# EAGLE design BB-8 Dome FX Module (EAGLE 7.5.0)
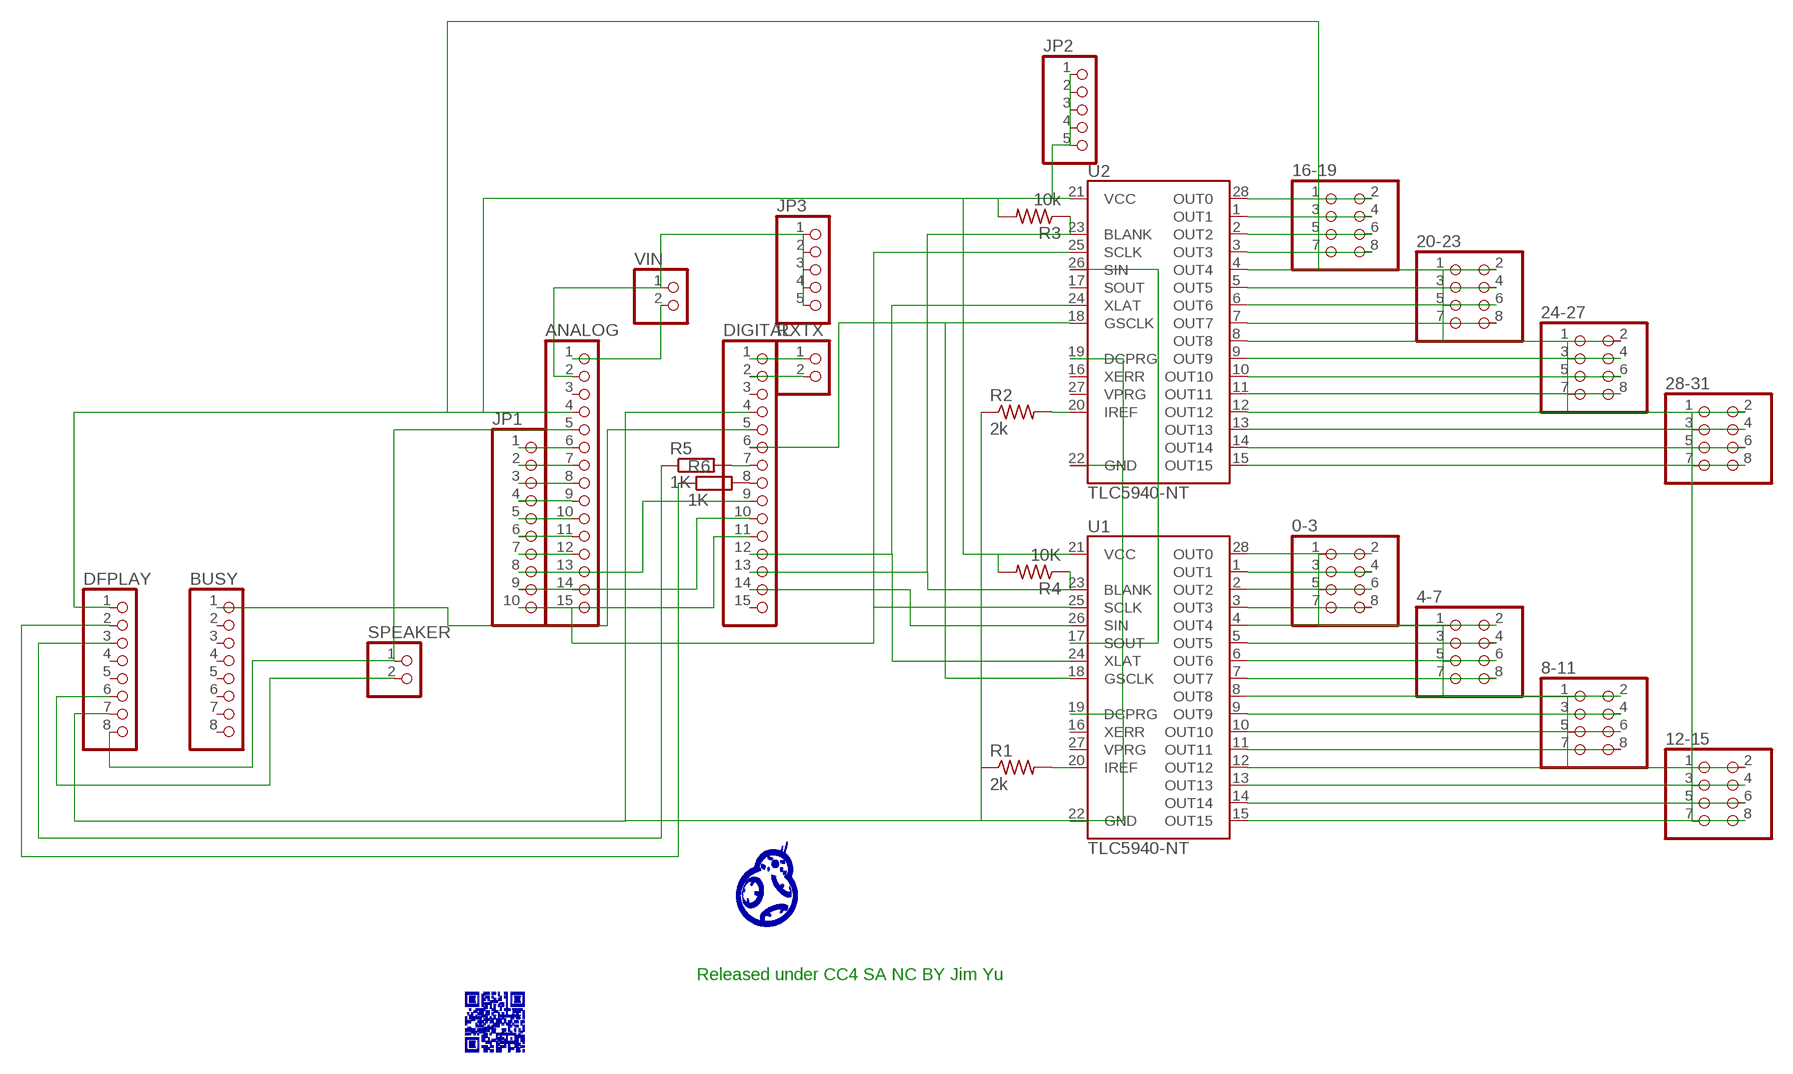
[diagram p0: schematic, sheet 1]

## Parts
0-3  PINHD-2X4  [2X04]
4-7  PINHD-2X4  [2X04]
8-11  PINHD-2X4  [2X04]
12-15  PINHD-2X4  [2X04]
16-19  PINHD-2X4  [2X04]
20-23  PINHD-2X4  [2X04]
24-27  PINHD-2X4  [2X04]
28-31  PINHD-2X4  [2X04]
ANALOG  PINHD-1X15  [1X15]
BUSY  PINHD-1X8  [1X08]
DFPLAY  PINHD-1X8  [1X08]
DIGITAL  PINHD-1X15  [1X15]
JP1  PINHD-1X10  [1X10]
JP2  PINHD-1X5  [1X05]
JP3  PINHD-1X5  [1X05]
R1  2k  R-US_0204/5  [0204/5]
R2  2k  R-US_0204/5  [0204/5]
R3  10k  R-US_0204/5  [0204/5]
R4  10K  R-US_0204/5  [0204/5]
R5  1K  R-EU_0204/5  [0204/5]
R6  1K  R-EU_0204/5  [0204/5]
RXTX  PINHD-1X2  [1X02]
SPEAKER  PINHD-1X2  [1X02]
U1  TLC5940-NT  [DIL28-3]
U2  TLC5940-NT  [DIL28-3]
VIN  PINHD-1X2  [1X02]

## Nets
N$1: DIGITAL.7 R5.2
N$2: U1.17(SOUT) U2.26(SIN)
N$3: DIGITAL.13 R3.1 R4.1 U1.23(BLANK) U2.23(BLANK)
N$4: DIGITAL.12 U1.24(XLAT) U2.24(XLAT)
N$5: DIGITAL.14 U1.26(SIN)
N$6: DIGITAL.6 U1.18(GSCLK) U2.18(GSCLK)
N$7: ANALOG.15 U1.25(SCLK) U2.25(SCLK)
N$8: DFPLAY.3 R5.1
N$9: R2.2 U2.20(IREF)
N$10: R1.2 U1.20(IREF)
N$11: DFPLAY.2 R6.1
N$12: DIGITAL.1 RXTX.1
N$13: 16-19.4 U2.1(OUT1)
N$14: DIGITAL.2 RXTX.2
N$16: 20-23.2 U2.4(OUT4)
N$17: 20-23.4 U2.5(OUT5)
N$28: 0-3.2 U1.28(OUT0)
N$29: 0-3.4 U1.1(OUT1)
N$30: 0-3.6 U1.2(OUT2)
N$31: 0-3.8 U1.3(OUT3)
N$33: 4-7.4 U1.5(OUT5)
N$36: 8-11.2 U1.8(OUT8)
N$37: 8-11.4 U1.9(OUT9)
N$38: 8-11.6 U1.10(OUT10)
N$39: 8-11.8 U1.11(OUT11)
N$41: 12-15.4 U1.13(OUT13)
N$42: 12-15.6 U1.14(OUT14)
N$43: 0-3.1 0-3.3 0-3.5 0-3.7 4-7.1 4-7.3 4-7.5 4-7.7 8-11.1 8-11.3 8-11.5 8-11.7 12-15.1 12-15.3 12-15.5 12-15.7 16-19.1 16-19.3 16-19.5 16-19.7 20-23.1 20-23.3 20-23.5 20-23.7 24-27.1 24-27.3 24-27.5 24-27.7 28-31.1 28-31.3 28-31.5 28-31.7 ANALOG.4 DFPLAY.1 JP2.1 JP2.2 JP2.3 JP2.4 JP2.5 R3.2 R4.2 U1.21(VCC) U2.21(VCC)
N$44: 12-15.8 U1.15(OUT15)
N$45: BUSY.1 DIGITAL.5
N$46: ANALOG.5 DFPLAY.8 SPEAKER.1
N$47: DFPLAY.6 SPEAKER.2
N$48: DFPLAY.7 DIGITAL.4 R1.1 R2.1 U1.19(DCPRG) U1.22(GND) U2.19(DCPRG) U2.22(GND)
N$49: DIGITAL.8 R6.2
N$50: ANALOG.1 VIN.2
N$51: ANALOG.2 JP3.1 JP3.2 JP3.3 JP3.4 JP3.5 VIN.1
N$52: ANALOG.6 JP1.1
N$53: ANALOG.7 JP1.2
N$54: ANALOG.8 JP1.3
N$55: ANALOG.9 JP1.4
N$56: ANALOG.10 JP1.5
N$57: ANALOG.11 JP1.6
N$58: ANALOG.12 JP1.7
N$59: DIGITAL.9 JP1.8
N$60: DIGITAL.10 JP1.9
N$61: DIGITAL.11 JP1.10
N$63: 28-31.8 U2.15(OUT15)
N$64: 28-31.6 U2.14(OUT14)
N$65: 28-31.4 U2.13(OUT13)
N$66: 28-31.2 U2.12(OUT12)
N$67: 24-27.8 U2.11(OUT11)
N$68: 24-27.6 U2.10(OUT10)
N$69: 24-27.4 U2.9(OUT9)
N$70: 24-27.2 U2.8(OUT8)
N$71: 20-23.8 U2.7(OUT7)
N$72: 20-23.6 U2.6(OUT6)
N$75: 16-19.8 U2.3(OUT3)
N$76: 16-19.6 U2.2(OUT2)
N$78: 16-19.2 U2.28(OUT0)
N$82: 12-15.2 U1.12(OUT12)
N$87: 4-7.8 U1.7(OUT7)
N$88: 4-7.6 U1.6(OUT6)
N$93: 4-7.2 U1.4(OUT4)
Unconnected: ANALOG.3 ANALOG.13 ANALOG.14 BUSY.2 BUSY.3 BUSY.4 BUSY.5 BUSY.6 BUSY.7 BUSY.8 DFPLAY.4 DFPLAY.5 DIGITAL.3 DIGITAL.15 U1.16(XERR) U1.27(VPRG) U2.16(XERR) U2.17(SOUT) U2.27(VPRG)

## Notes on the sheet
- Released under CC4 SA NC BY Jim Yu
- C:/Users/jimha/Desktop/FB.bmp

## Library data of the parts
0-3 4-7 8-11 12-15 16-19 20-23 24-27 28-31 = pinhead:PINHD-2X4: PIN HEADER
ANALOG DIGITAL = pinhead:PINHD-1X15: PIN HEADER
BUSY DFPLAY = pinhead:PINHD-1X8: PIN HEADER
JP1 = pinhead:PINHD-1X10: PIN HEADER
JP2 JP3 = pinhead:PINHD-1X5: PIN HEADER
R1-R4 = rcl:R-US_: RESISTOR, American symbol
R5 R6 = rcl:R-EU_: RESISTOR, European symbol
RXTX SPEAKER VIN = pinhead:PINHD-1X2: PIN HEADER
U1 U2 = SparkFun-DigitalIC:TLC5940: 16-channel LED Driver with Dot Correction and Grayscale PWM Control The TLC5940 is a 16-channel, constant-current sink LED driver. Each channel has an individually adjustable 4096-step grayscale PWM brightness control and a 64-step, constant-current sink (dot correction). The dot correction adjusts the brightness variations between LED channels and other LED drivers. The dot correction data is stored in an integrated EEPROM. Both grayscale control and dot correction are accessible via a serial interface. A single external resistor sets the maximum current value of all 16 channels. Packages: 28-pin HTSSOP 32-pin 5x5mm QFN 28-pin DIP

## Board
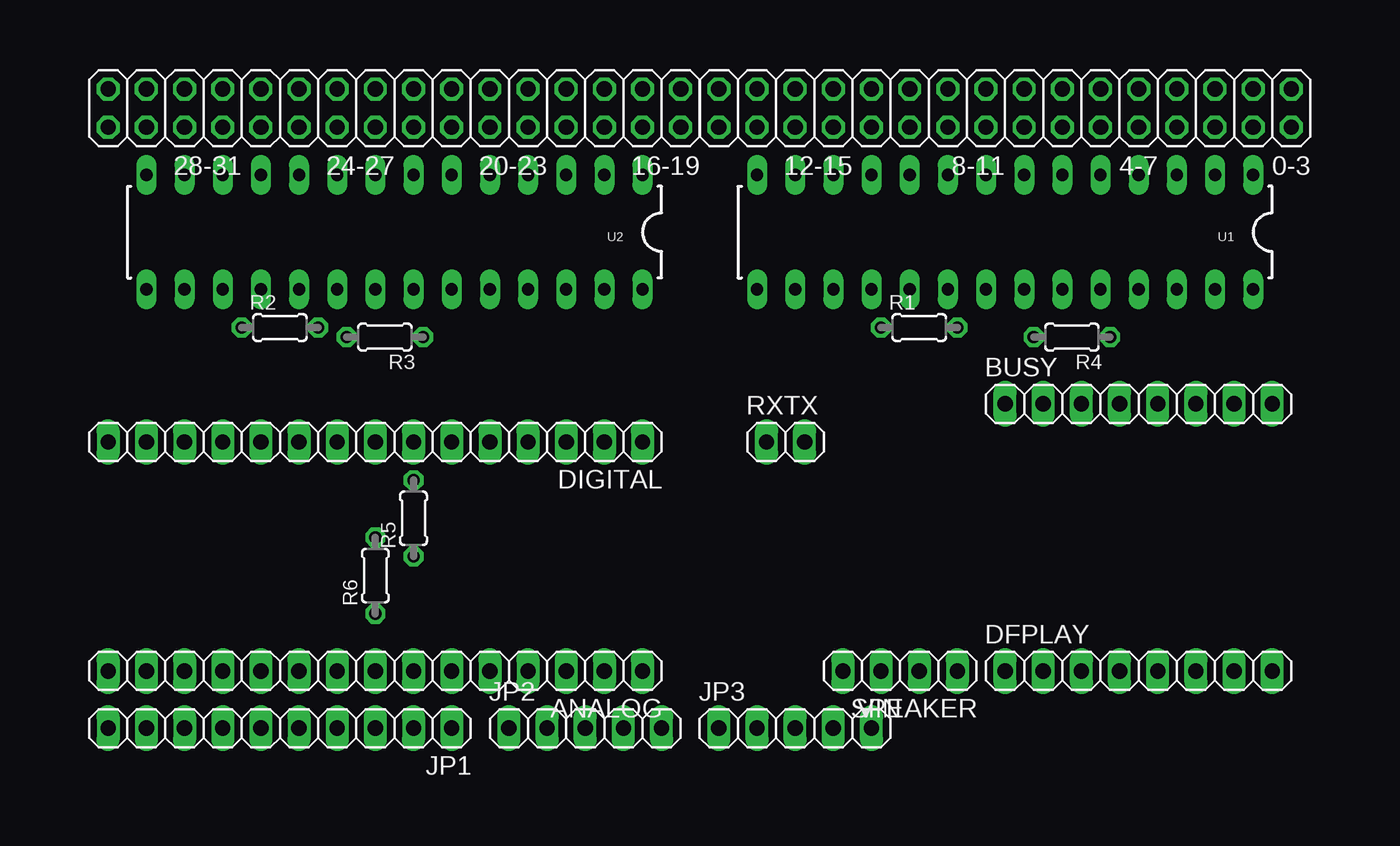
[diagram p1: board, top side]
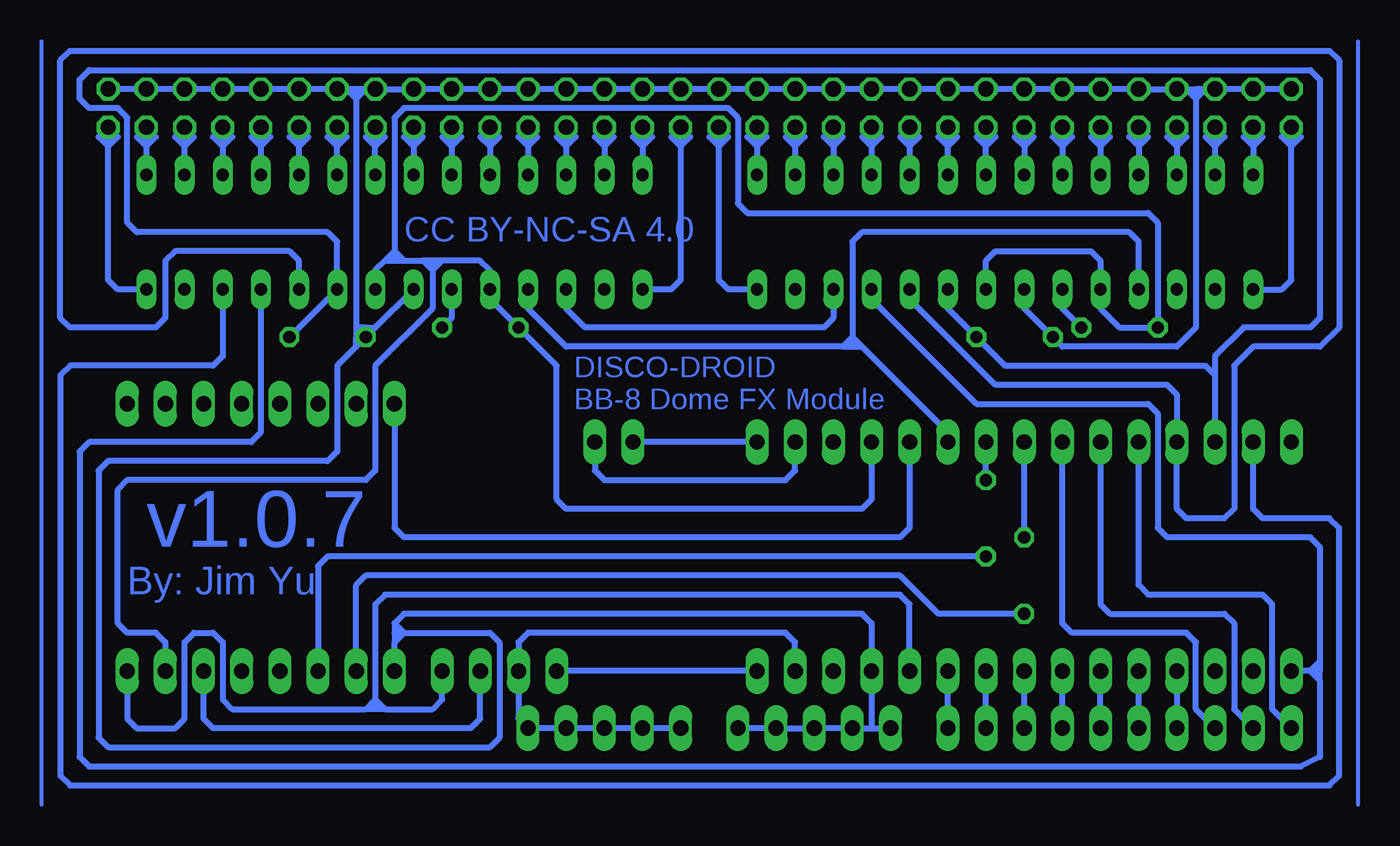
[diagram p2: board, bottom side, seen from below]

No outline drawn. Coordinates in mm, seen from the top.
Copper layers (1*16): Top 0.035mm / dielectric 1.5mm / Bottom 0.035mm
Design rules "default": minimum track width 10mil, minimum drill 24mil, track to track 8mil, track to pad 8mil, pad to pad 8mil, via to via 8mil, smd to smd 8mil, copper to edge 40mil, drill to drill 8mil, minimum pad ring 10mil, minimum via ring 8mil, stop-mask expansion 4mil, vias tented up to drill 0mil, thermal gap 10mil

### Footprints (pad centres in the part's own frame; a part is rotated, then mirrored left to right if it is on the bottom)
2X04 = drill 1.016 octagon: 1 -3.81,-1.27; 2 -3.81,1.27; 3 -1.27,-1.27; 4 -1.27,1.27; 5 1.27,-1.27; 6 1.27,1.27; 7 3.81,-1.27; 8 3.81,1.27
1X15 = drill 1.016 long: 1 -17.78,0; 2 -15.24,0; 3 -12.7,0; 4 -10.16,0; 5 -7.62,0; 6 -5.08,0; 7 -2.54,0; 8 0,0; 9 2.54,0; 10 5.08,0; 11 7.62,0; 12 10.16,0; 13 12.7,0; 14 15.24,0; 15 17.78,0
1X08 = drill 1.016 long: 1 -8.89,0; 2 -6.35,0; 3 -3.81,0; 4 -1.27,0; 5 1.27,0; 6 3.81,0; 7 6.35,0; 8 8.89,0
1X10 = drill 1.016 long: 1 -11.43,0; 2 -8.89,0; 3 -6.35,0; 4 -3.81,0; 5 -1.27,0; 6 1.27,0; 7 3.81,0; 8 6.35,0; 9 8.89,0; 10 11.43,0
1X05 = drill 1.016 long: 1 -5.08,0; 2 -2.54,0; 3 0,0; 4 2.54,0; 5 5.08,0
0204/5 = drill 0.813 octagon: 1 -2.54,0; 2 2.54,0
1X02 = drill 1.016 long: 1 -1.27,0; 2 1.27,0
DIL28-3 = drill 0.813 long: 1 -16.51,-3.81; 2 -13.97,-3.81; 3 -11.43,-3.81; 4 -8.89,-3.81; 5 -6.35,-3.81; 6 -3.81,-3.81; 7 -1.27,-3.81; 8 1.27,-3.81; 9 3.81,-3.81; 10 6.35,-3.81; 11 8.89,-3.81; 12 11.43,-3.81; 13 13.97,-3.81; 14 16.51,-3.81; 15 16.51,3.81; 16 13.97,3.81; 17 11.43,3.81; 18 8.89,3.81; 19 6.35,3.81; 20 3.81,3.81; 21 1.27,3.81; 22 -1.27,3.81; 23 -3.81,3.81; 24 -6.35,3.81; 25 -8.89,3.81; 26 -11.43,3.81; 27 -13.97,3.81; 28 -16.51,3.81

### Placement (x,y rotation side)
0-3  79.38,46.35 180 top
4-7  69.22,46.35 180 top
8-11  59.05,46.35 180 top
12-15  48.9,46.35 180 top
16-19  38.73,46.35 180 top
20-23  28.57,46.35 180 top
24-27  18.41,46.35 180 top
28-31  8.26,46.35 180 top
ANALOG  22.23,8.89 180 top
BUSY  73.03,26.67 0 top
DFPLAY  73.03,8.89 0 top
DIGITAL  22.23,24.13 180 top
JP1  15.88,5.08 180 top
JP2  36.2,5.08 0 top
JP3  50.16,5.08 0 top
R1  58.42,31.75 0 top
R2  15.88,31.75 0 top
R3  22.86,31.11 180 top
R4  68.58,31.11 180 top
R5  24.77,19.05 90 top
R6  22.23,15.24 90 top
RXTX  49.53,24.13 0 top
SPEAKER  59.69,8.89 180 top
U1  64.14,38.1 180 top
U2  23.5,38.1 180 top
VIN  54.61,8.89 180 top

### Tracks (layer width: path | path; a pad name or v marks a point on that pad's centre or on a via)
N$1
  Bottom 0.406: R5.2 DIGITAL.7
N$2
  Bottom 0.381: 52.7,33.02 U1.17
  Bottom 0.406: U2.26 34.92,32.38 35.56,31.75 51.44,31.75 52.7,33.02
N$3
  Bottom 0.406: 9.53,28.57 9.53,29.84 7.62,31.75 3.17,31.75 2.54,32.38 2.54,48.26 3.17,48.9 84.45,48.9 85.09,48.26 85.09,46.99 84.45,46.35 82.55,46.35 81.92,45.72 81.92,38.73 81.28,38.1 68.58,38.1 67.94,37.47 U1.23 R4.1 | 9.53,28.57 DIGITAL.13 | U2.23 27.3,33.02 R3.1 23.5,29.21 10.16,29.21 9.53,28.57
N$4
  Bottom 0.406: U1.24 70.48,36.2 71.12,36.83 78.74,36.83 79.38,36.2 79.38,32.38 80.01,31.75 85.72,31.75 86.36,32.38 86.36,49.53 85.72,50.16 1.91,50.16 1.27,49.53 1.27,31.75 2.54,30.48 6.99,30.48 8.26,29.21 8.26,19.68 8.89,19.05 11.43,19.05 12.06,19.68 DIGITAL.12 12.06,27.3 12.7,27.94 24.13,27.94 29.84,33.66 U2.24
N$5
  Bottom 0.406: U1.26 75.56,29.84 76.2,29.21 85.72,29.21 86.36,28.57 86.36,1.91 85.72,1.27 1.91,1.27 1.27,1.91 1.27,18.41 1.91,19.05 6.35,19.05 6.99,19.68 DIGITAL.14
N$6
  Bottom 0.406: DIGITAL.6 27.3,24.77 33.02,30.48 | U2.18 14.61,37.47 15.24,38.1 33.02,38.1 33.66,37.47 33.66,31.11 | 34.29,30.48 33.66,31.11 | 34.29,30.48 33.66,30.48 | 33.66,30.48 33.02,30.48 | 33.02,30.48 33.66,31.11 | 33.66,31.11 33.66,30.48 | 34.29,30.48 52.7,30.48 55.24,33.02 U1.18
N$7
  Bottom 0.406: U1.25 73.03,24.77 73.66,24.13 84.45,24.13 85.09,23.5 85.09,3.17 84.45,2.54 3.81,2.54 2.54,3.17 2.54,8.26 | 2.54,9.53 2.54,17.14 3.17,17.78 12.7,17.78 13.34,18.41 13.34,26.04 13.97,26.67 25.4,26.67 32.38,33.66 U2.25 | 3.17,8.89 3.81,8.89 ANALOG.15 | 2.54,9.53 3.17,8.89 | 2.54,8.26 3.17,8.89 | 2.54,9.53 2.54,8.89 | 2.54,8.26 2.54,8.89 | 2.54,8.89 3.17,8.89
N$8
  Bottom 0.406: R5.1 68.58,16.51 69.22,15.88 DFPLAY.3
N$9
  Bottom 0.406: R2.2 19.68,33.02 U2.20
N$10
  Bottom 0.406: U1.20 60.33,32.38 R1.2
N$11
  Bottom 0.406: DFPLAY.2 66.67,14.61 66.04,15.24 30.48,15.24 27.94,12.7 R6.1
N$12
  Bottom 0.406: DIGITAL.1 RXTX.1
N$13
  Bottom 0.406: 16-19.4 40.01,43.81 | 40.01,43.81 U2.1 | 40.01,43.81 39.37,44.45 40.64,44.45 40.01,43.81
N$14
  Bottom 0.406: RXTX.2 50.8,22.23 50.16,21.59 38.1,21.59 37.47,22.23 DIGITAL.2
N$15
  Bottom 0.254: 0,0 0,50.8
N$16
  Bottom 0.406: 20-23.2 32.38,43.81 | 32.38,43.81 U2.4 | 32.38,43.81 31.75,44.45 33.02,44.45 32.38,43.81
N$17
  Bottom 0.406: 20-23.4 29.84,43.81 | 29.84,43.81 U2.5 | 29.84,43.81 29.21,44.45 30.48,44.45 29.84,43.81
N$28
  Bottom 0.406: 83.19,43.81 83.19,34.92 82.55,34.29 U1.28 | 83.19,43.81 0-3.2 | 83.19,43.81 82.55,44.45 83.82,44.45 83.19,43.81
N$29
  Bottom 0.406: 0-3.4 80.64,43.81 | 80.64,43.81 U1.1 | 80.64,43.81 80.01,44.45 81.28,44.45 80.64,43.81
N$30
  Bottom 0.406: U1.2 78.11,43.81 | 78.11,43.81 0-3.6 | 78.11,43.81 77.47,44.45 78.74,44.45 78.11,43.81
N$31
  Bottom 0.406: 75.56,43.81 U1.3 | 0-3.8 75.56,43.81 | 75.56,43.81 74.93,44.45 76.2,44.45 75.56,43.81
N$33
  Bottom 0.406: U1.5 70.48,43.81 | 70.48,43.81 4-7.4 | 70.48,43.81 69.85,44.45 71.12,44.45 70.48,43.81
N$36
  Bottom 0.406: 8-11.2 62.87,43.81 | 62.87,43.81 U1.8 | 62.87,43.81 62.23,44.45 63.5,44.45 62.87,43.81
N$37
  Bottom 0.406: 8-11.4 60.33,43.81 | 60.33,43.81 U1.9 | 60.33,43.81 59.69,44.45 60.96,44.45 60.33,43.81
N$38
  Bottom 0.406: 8-11.6 57.78,43.81 | 57.78,43.81 U1.10 | 57.78,43.81 57.15,44.45 58.42,44.45 57.78,43.81
N$39
  Bottom 0.406: 8-11.8 55.24,44.45 | 55.24,43.81 U1.11 | 55.24,44.45 54.61,44.45 55.24,43.81 | 55.24,43.81 55.24,44.45 | 55.24,44.45 55.88,44.45 55.24,43.81
N$41
  Bottom 0.406: 12-15.4 50.16,43.81 | 50.16,43.81 U1.13 | 50.16,43.81 49.53,44.45 50.8,44.45 50.16,43.81
N$42
  Bottom 0.406: 12-15.6 47.62,43.81 | 47.62,43.81 U1.14 | 47.62,43.81 46.99,44.45 48.26,44.45 47.62,43.81
N$43
  Bottom 0.406: 28-31.7 28-31.5 28-31.3 10.16,47.62 | 10.16,47.62 10.79,47.62 | 11.43,47.62 28-31.1 24-27.7 24-27.5 24-27.3 24-27.1 20-23.7 20-23.5 20-23.3 20-23.1 16-19.7 16-19.5 16-19.3 16-19.1 12-15.7 12-15.5 12-15.3 12-15.1 8-11.7 8-11.5 8-11.3 8-11.1 4-7.7 66.04,47.62 | 67.31,47.62 4-7.5 4-7.3 4-7.1 0-3.7 0-3.5 0-3.3 0-3.1 | 10.79,46.99 10.16,47.62 | DFPLAY.1 64.14,10.79 | U2.21 22.23,33.02 R3.2 19.68,30.48 12.06,30.48 10.79,31.75 10.79,46.99 | 10.79,46.99 11.43,47.62 | 11.43,47.62 10.79,47.62 | 10.79,47.62 10.79,46.99 | 66.67,46.99 66.04,47.62 | 66.04,47.62 66.67,47.62 | 66.67,47.62 67.31,47.62 | 67.31,47.62 66.67,46.99 | 66.67,46.99 66.67,47.62 | 63.5,11.43 57.78,11.43 57.15,10.79 57.15,4.45 57.78,3.81 83.19,3.81 83.82,4.45 83.82,22.23 83.19,22.86 68.58,22.86 67.94,23.5 67.94,29.21 66.67,30.48 | 64.14,10.79 63.5,11.43 | 64.14,12.06 63.5,12.7 33.02,12.7 32.39,12.07 ANALOG.4 32.39,5.08 32.38,5.08 | 64.14,11.43 64.14,10.79 | 63.5,11.43 64.14,12.06 | 64.14,12.06 64.14,11.43 | 64.14,11.43 63.5,11.43 | 32.38,5.08 33.02,5.08 34.29,5.08 JP2.2 JP2.3 JP2.4 JP2.5 | 32.38,5.08 JP2.1 | 66.67,46.99 66.67,31.75 | 66.67,31.75 R4.2 | U1.21 65.41,31.75 | 65.41,31.75 R4.2 | R4.2 66.67,30.48 | 66.67,31.75 66.67,31.11 | 66.67,30.48 66.67,31.11 | 66.67,31.11 R4.2 | R4.2 66.04,31.75 | 66.04,31.75 65.41,31.75 | 66.04,31.75 66.67,31.75
N$44
  Bottom 0.406: 12-15.8 45.09,43.81 | 45.09,43.81 45.09,34.92 45.72,34.29 U1.15 | 45.09,43.81 44.45,44.45 45.72,44.45 45.09,43.81
N$45
  Bottom 0.406: DIGITAL.5 29.84,18.41 30.48,17.78 63.5,17.78 64.14,18.41 BUSY.1
N$46
  Bottom 0.406: ANALOG.5 29.85,13.34 30.48,13.97 64.77,13.97 65.41,13.34 65.41,6.99 | 65.41,6.99 64.77,6.35 | 64.77,6.35 61.59,6.35 60.96,6.99 SPEAKER.1 | DFPLAY.8 81.92,5.71 81.28,5.08 78.74,5.08 78.11,5.71 78.11,10.79 77.47,11.43 76.2,11.43 75.56,10.79 75.56,6.99 74.93,6.35 66.04,6.35 | 64.77,6.35 65.41,6.35 | 65.41,6.35 66.04,6.35 | 66.04,6.35 65.41,6.99 | 65.41,6.99 65.41,6.35
N$47
  Bottom 0.406: DFPLAY.6 76.83,5.71 76.2,5.08 59.05,5.08 58.42,5.71 SPEAKER.2
N$48
  Bottom 0.406: U2.22 24.77,36.2 24.13,36.83 17.78,36.83 17.14,36.2 U2.19 17.14,33.02 15.88,31.75 R2.1 13.34,38.73 13.97,39.37 40.64,39.37 41.27,40.01 41.27,45.72 41.91,46.35 63.5,46.35 64.14,45.72 64.14,36.83 | U1.22 65.41,35.56 64.77,36.2 | 64.14,36.2 63.5,36.2 | 63.5,36.2 62.23,36.2 | 61.59,35.56 61.59,33.02 65.41,29.21 65.41,22.23 66.04,21.59 81.92,21.59 82.55,20.95 82.55,12.06 81.92,11.43 80.01,11.43 79.38,10.79 DFPLAY.7 | 60.96,36.2 58.42,36.2 57.78,35.56 U1.19 57.78,33.66 R1.1 53.34,29.21 53.34,20.32 52.7,19.68 33.02,19.68 32.38,20.32 DIGITAL.4 | 60.96,36.2 61.59,36.2 | 61.59,36.2 61.59,35.56 | 61.59,35.56 60.96,36.2 | 61.59,36.2 62.23,36.2 | 62.23,36.2 61.59,35.56 | 64.14,36.83 63.5,36.2 | 64.77,36.2 64.14,36.2 | 64.14,36.2 64.14,36.83 | 64.14,36.83 64.77,36.2
N$49
  Bottom 0.406: R6.2 DIGITAL.8
N$50
  Bottom 0.406: ANALOG.1 40.64,8.89 VIN.2
N$51
  Bottom 0.406: ANALOG.2 37.47,10.8 38.1,11.43 55.24,11.43 55.88,10.79 VIN.1 55.88,5.71 JP3.5 | JP3.1 JP3.2 | JP3.2 JP3.3 JP3.4 JP3.5 | JP3.2 JP3.5
N$52
  Bottom 0.406: JP1.1 ANALOG.6
N$53
  Bottom 0.406: JP1.2 ANALOG.7
N$54
  Bottom 0.406: JP1.3 ANALOG.8
N$55
  Bottom 0.406: JP1.4 ANALOG.9
N$56
  Bottom 0.406: JP1.5 17.14,8.25 ANALOG.10
N$57
  Bottom 0.406: JP1.6 ANALOG.11
N$58
  Bottom 0.406: ANALOG.12 12.07,6.35 12.06,5.71 JP1.7
N$59
  Bottom 0.406: JP1.8 10.79,6.35 10.79,10.79 11.43,11.43 19.05,11.43 19.68,12.06 DIGITAL.9
N$60
  Bottom 0.406: DIGITAL.10 17.14,13.34 16.51,12.7 8.89,12.7 8.26,12.06 8.26,6.35 JP1.9
N$61
  Bottom 0.406: JP1.10 5.71,6.35 5.71,13.34 6.35,13.97 13.97,13.97 14.61,14.61 DIGITAL.11
N$62
  Bottom 0.254: 87.63,50.8 87.63,0
N$63
  Bottom 0.406: U2.15 5.08,34.29 4.45,34.92 4.45,43.81 | 4.45,43.81 28-31.8 | 4.45,43.81 3.81,44.45 5.08,44.45 4.45,43.81
N$64
  Bottom 0.406: 28-31.6 6.99,43.81 | 6.99,43.81 U2.14 | 6.99,43.81 6.35,44.45 7.62,44.45 6.99,43.81
N$65
  Bottom 0.406: 28-31.4 9.53,43.81 | 9.53,43.81 U2.13 | 9.53,43.81 8.89,44.45 10.16,44.45 9.53,43.81
N$66
  Bottom 0.406: 28-31.2 12.06,43.81 | 12.06,43.81 U2.12 | 12.06,43.81 11.43,44.45 12.7,44.45 12.06,43.81
N$67
  Bottom 0.406: 24-27.8 14.61,43.81 | 14.61,43.81 U2.11 | 14.61,43.81 13.97,44.45 15.24,44.45 14.61,43.81
N$68
  Bottom 0.406: 24-27.6 17.14,43.81 | 17.14,43.81 U2.10 | 17.14,43.81 16.51,44.45 17.78,44.45 17.14,43.81
N$69
  Bottom 0.406: 24-27.4 19.68,43.81 | 19.68,43.81 U2.9 | 19.68,43.81 19.05,44.45 20.32,44.45 19.68,43.81
N$70
  Bottom 0.406: 24-27.2 22.23,43.81 | 22.23,43.81 U2.8 | 22.23,43.81 21.59,44.45 22.86,44.45 22.23,43.81
N$71
  Bottom 0.406: U2.7 24.77,43.81 | 24.77,43.81 20-23.8 | 24.77,43.81 24.13,44.45 25.4,44.45 24.77,43.81
N$72
  Bottom 0.406: U2.6 27.3,43.81 | 27.3,43.81 20-23.6 | 27.3,43.81 26.67,44.45 27.94,44.45 27.3,43.81
N$75
  Bottom 0.406: 16-19.8 34.92,43.81 | 34.92,43.81 U2.3 | 34.92,43.81 34.29,44.45 35.56,44.45 34.92,43.81
N$76
  Bottom 0.406: 16-19.6 37.47,43.81 | 37.47,43.81 U2.2 | 37.47,43.81 36.83,44.45 38.1,44.45 37.47,43.81
N$78
  Bottom 0.406: U2.28 41.91,34.29 42.55,34.92 42.55,43.81 | 42.55,43.81 16-19.2 | 42.55,43.81 41.91,44.45 43.18,44.45 42.55,43.81
N$82
  Bottom 0.406: 12-15.2 52.7,43.81 | 52.7,43.81 U1.12 | 52.7,43.81 52.07,44.45 53.34,44.45 52.7,43.81
N$87
  Bottom 0.406: U1.7 65.41,43.81 | 65.41,43.81 4-7.8 | 65.41,43.81 64.77,44.45 66.04,44.45 65.41,43.81
N$88
  Bottom 0.406: U1.6 67.94,43.81 | 67.94,43.81 4-7.6 | 67.94,43.81 68.58,44.45 67.31,44.45 67.94,43.81
N$93
  Bottom 0.406: 4-7.2 73.03,43.81 | 73.03,43.81 U1.4 | 73.03,43.81 72.39,44.45 73.66,44.45 73.03,43.81

### Text on the board
Bottom: CC BY-NC-SA 4.0 | DISCO-DROID / BB-8 Dome FX Module | v1.0.7 | By: Jim Yu
tPlace: C:/Users/jimha/Desktop/Untitled-2.bmp